# Altium schematic sheet v2car.SchDoc
size A4
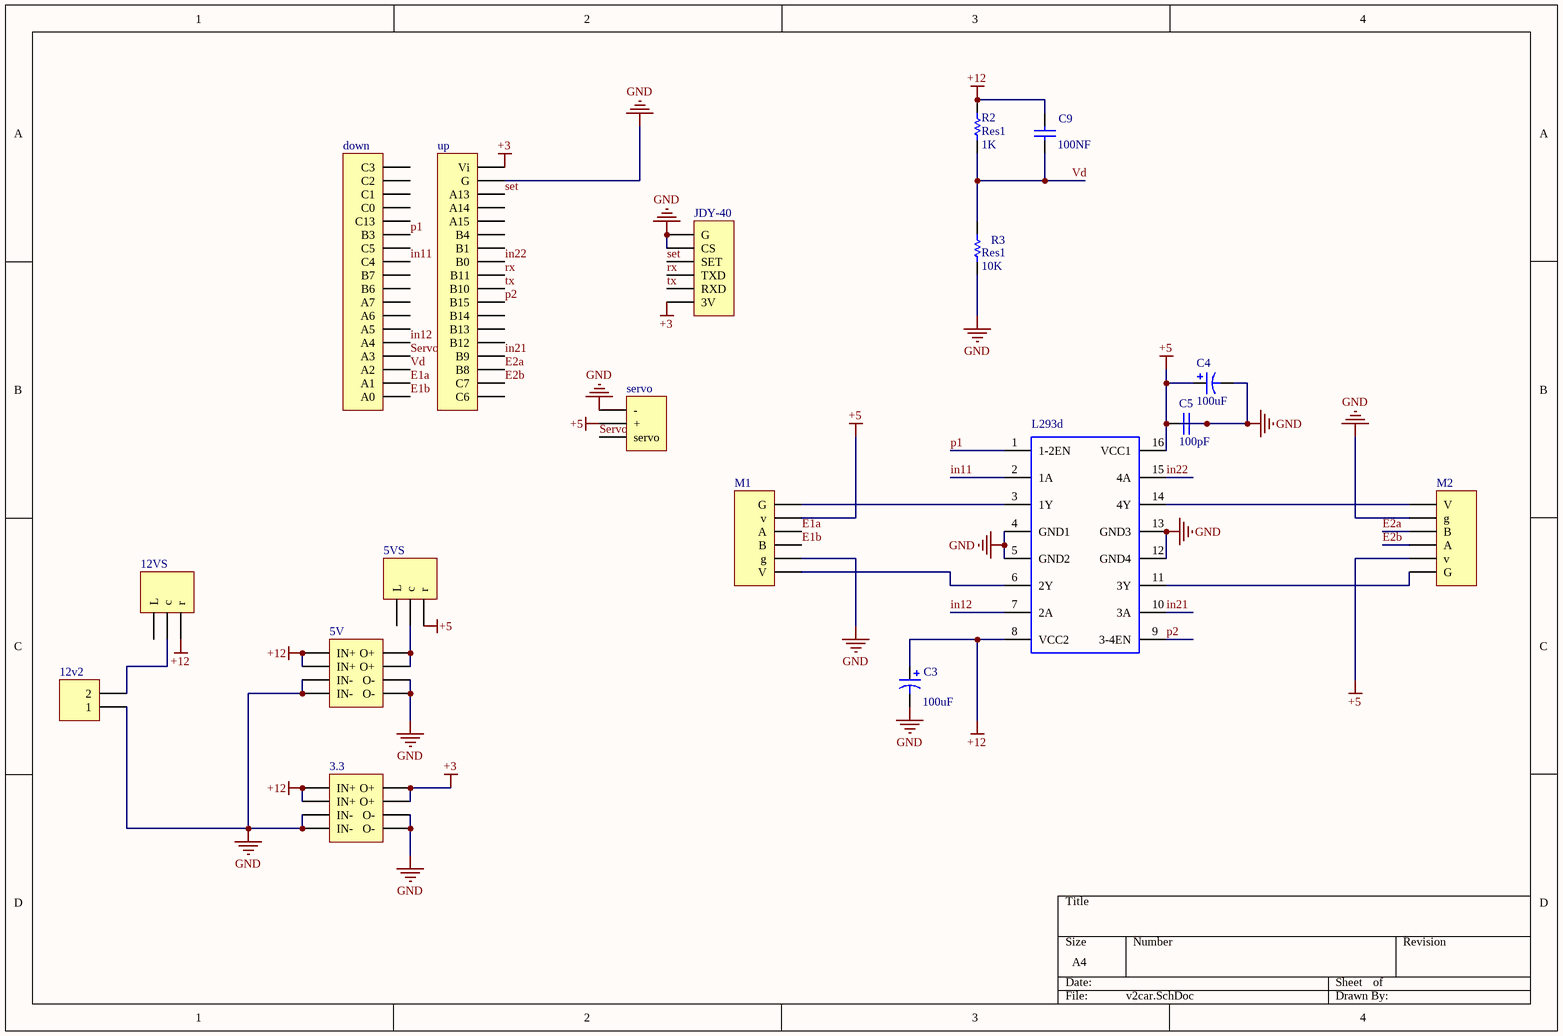
[diagram p0: v2car.SchDoc]

## Parts
3.3  Header 4X2  [PCBComponent_1]  (value not drawn)
5V  Header 4X2  [PCBComponent_1]  (value not drawn)
5VS  Header 3  [HDR1X3]  (value not drawn)
12v2  Header 2  [HDR1X2]  (value not drawn)
12VS  Header 3  [HDR1X3]  (value not drawn)
C3  value 100uF  [0805]  (hidden comment: Cap Pol1)
C4  value 100uF  [0805]  (hidden comment: Cap Pol1)
C5  value 100pF  [0805]  (hidden comment: Cap)
C9  value 100NF  [0805]  (hidden comment: Cap)
down  Header 18H  [HDR1X18]  (value not drawn)
JDY-40  MHDR1X6  [JDY-401]  (value not drawn)
L293d  (no value)  [PCBComponent_1]
M1  Header 6  [PCBComponent_1]  (value not drawn)
M2  Header 6  [PCBComponent_1]  (value not drawn)
R2  Res1  value 1K  [0805]
R3  Res1  value 10K  [0805]
servo  Header 3  [HDR1X3]  (value not drawn)
up  Header 18  [HDR1X18]  (value not drawn)

## Nets
+3: 3.3.2(O+) 3.3.4(O+) JDY-40.6(3V) up.18(Vi)
+5: 5VS.3(r) C4.1 C5.2 L293d.16(VCC1) M1.5(v) M2.5(v) servo.2(+)
+12: 3.3.1(IN+) 3.3.3(IN+) 5V.1(IN+) 5V.3(IN+) 12VS.3(r) C3.1 C9.1 L293d.8(VCC2) R2.2
GND: 3.3.5(IN-) 3.3.6(O-) 3.3.7(IN-) 3.3.8(O-) 5V.5(IN-) 5V.6(O-) 5V.7(IN-) 5V.8(O-) 12v2.1 C3.2 C4.2 C5.1 JDY-40.1(G) JDY-40.2(CS) L293d.4(GND1) L293d.5(GND2) L293d.12(GND4) L293d.13(GND3) M1.2(g) M2.2(g) R3.1 servo.1(-) up.17(G)
E1a: down.2(A1) M1.4(A)
E1b: down.1(A0) M1.3(B)
E2a: M2.3(B) up.3(B8)
E2b: M2.4(A) up.2(C7)
in11: down.11(C4) L293d.2(1A)
in12: down.5(A4) L293d.7(2A)
in21: L293d.10(3A) up.4(B9)
in22: L293d.15(4A) up.11(B0)
p1: down.13(B3) L293d.1(1-2EN)
p2: L293d.9(3-4EN) up.8(B15)
rx: JDY-40.4(TXD) up.10(B11)
Servo: down.4(A3) servo.3(servo)
set: JDY-40.3(SET) up.16(A13)
tx: JDY-40.5(RXD) up.9(B10)
Vd: C9.2 down.3(A2) R2.1 R3.2
Net5V_2: 5V.2(O+) 5V.4(O+) 5VS.2(c)
Net12v2_2: 12v2.2 12VS.2(c)
NetL293d_3: L293d.3(1Y) M1.6(G)
NetL293d_6: L293d.6(2Y) M1.1(V)
NetL293d_11: L293d.11(3Y) M2.6(G)
NetL293d_14: L293d.14(4Y) M2.1(V)

Not connected (* = marked no-connect by the designer): 5VS 1(L); 12VS 1(L); down 6(A5) 7(A6) 8(A7) 9(B6) 10(B7) 12(C5) 14(C13) 15(C0) 16(C1) 17(C2) 18(C3); up 1(C6) 5(B12) 6(B13) 7(B14) 12(B1) 13(B4) 14(A15) 15(A14)

## Library data of the parts
3.3 5V = Header 4X2: Header, 4-Pin, Dual row; LatestRevisionDate: 17-Jul-2002; LatestRevisionNote: Re-released for DXP Platform.; Publisher: Altium Limited
5VS 12VS servo = Header 3: Header, 3-Pin; LatestRevisionDate: 17-Jul-2002; LatestRevisionNote: Re-released for DXP Platform.; Publisher: Altium Limited
12v2 = Header 2: Header, 2-Pin; LatestRevisionDate: 17-Jul-2002; LatestRevisionNote: Re-released for DXP Platform.; Publisher: Altium Limited
C3 C4 = Cap Pol1: Polarized Capacitor (Radial); Published: 8-Jun-2000; LatestRevisionDate: 17-Jul-2002; LatestRevisionNote: Re-released for DXP Platform.; PackageReference: RB7.6-15; Publisher: Altium Limited
C5 C9 = Cap: Capacitor; Published: 8-Jun-2000; LatestRevisionDate: 17-Jul-2002; LatestRevisionNote: Re-released for DXP Platform.; PackageReference: RAD-0.3; Publisher: Altium Limited
down = Header 18H: Header, 18-Pin, Right Angle; LatestRevisionDate: 17-Jul-2002; LatestRevisionNote: Re-released for DXP Platform.; Publisher: Altium Limited
JDY-40 = MHDR1X6: Header, 6-Pin; LatestRevisionDate: 17-Jul-2002; LatestRevisionNote: Re-released for DXP Platform.; Publisher: Altium Limited
L293d = L293E
M1 M2 = Header 6: Header, 6-Pin; LatestRevisionDate: 17-Jul-2002; LatestRevisionNote: Re-released for DXP Platform.; Publisher: Altium Limited
R2 R3 = Res1: Resistor; Published: 8-Jun-2000; LatestRevisionDate: 17-Jul-2002; LatestRevisionNote: Re-released for DXP Platform.; PackageReference: AXIAL-0.3; Publisher: Altium Limited; PackageDescription: Axial Device, Thru-Hole; 2 Leads; 0.3 in Pin Spacing
up = Header 18: Header, 18-Pin; LatestRevisionDate: 17-Jul-2002; LatestRevisionNote: Re-released for DXP Platform.; Publisher: Altium Limited